# Altium project 单电源同向放大器.PrjPCB
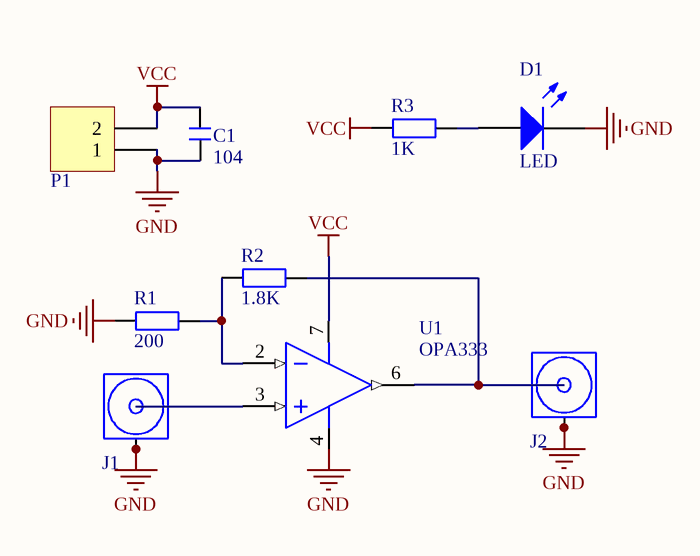
[diagram p0: 单电源同向放大器.SchDoc]
1 sheet, 9 parts. Net scope: global (net labels, ports and power ports of the same name join across sheets).
Board file: 单电源同向放大器.PcbDoc

## Sheet 单电源同向放大器.SchDoc
size A4

### Parts
C1  104  [C 0805]
D1  LED  [LED_0805]
J1  COAX  [MCX5.08-5-H]  (value not drawn)
J2  COAX  [MCX5.08-5-H]  (value not drawn)
P1  Header 2  [HDR2X1_B2]  (value not drawn)
R1  200  [R 0805]
R2  1.8K  [R 0805]
R3  1K  [R 0805]
U1  OPA333  [SO8_L]

### Nets
GND: C1.1 D1.2(K) J1.2(GND) J1.3(GND) J1.4(GND) J1.5(GND) J2.2(GND) J2.3(GND) J2.4(GND) J2.5(GND) P1.1 R1.1 U1.4(V-)
VCC: C1.2 P1.2 R3.1 U1.7(V+)
NetD1_1: D1.1(A) R3.2
NetJ1_1: J1.1(Signal) U1.3(IN+)
NetJ2_1: J2.1(Signal) R2.2 U1.6(OUT)
NetR1_2: R1.2 R2.1 U1.2(IN-)

### Library data of the parts
C1 = C: 无极性贴片电容; 版权归属: 源创客; BOM名称: 无极性贴片电容; 学习资源: www.ooocke.com
D1 = LED: 发光二极管; Published: 8-Jun-2000; LatestRevisionDate: 08-Jul-2005; LatestRevisionNote: Mech Layer 1 removed.; PackageReference: LED; Publisher: Altium Limited
P1 = Header 2: 接插件; LatestRevisionDate: 17-Jul-2002; LatestRevisionNote: Re-released for DXP Platform.; Publisher: Altium Limited
R1-R3 = R: 贴片电阻; 版权归属: 源创客; BOM名称: 贴片电阻; 学习资源: www.ooocke.com
U1 = OPA333: 1.8V 微功耗 CMOS 运算放大器零漂移系列